# Altium schematic sheet 28P1.SchDoc
size A4
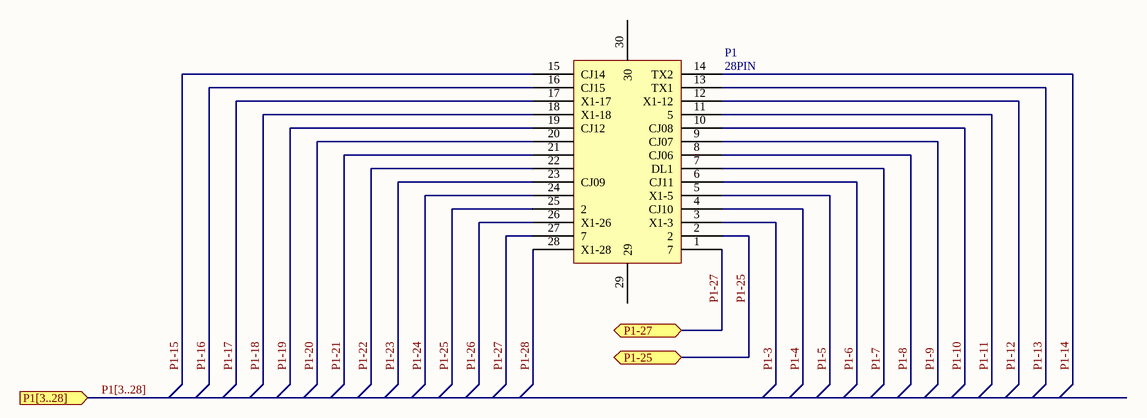
[diagram p0: 28P1.SchDoc]

## Parts
P1  28PIN  [2*14]

## Ports
P1-25, P1-27, P1[3..28]

## Nets
P1-3: P1.3(X1-3)
P1-4: P1.4(CJ10)
P1-5: P1.5(X1-5)
P1-6: P1.6(CJ11)
P1-7: P1.7(DL1)
P1-8: P1.8(CJ06)
P1-9: P1.9(CJ07)
P1-10: P1.10(CJ08)
P1-11: P1.11(5)
P1-12: P1.12(X1-12)
P1-13: P1.13(TX1)
P1-14: P1.14(TX2)
P1-15: P1.15(CJ14)
P1-16: P1.16(CJ15)
P1-17: P1.17(X1-17)
P1-18: P1.18(X1-18)
P1-19: P1.19(CJ12)
P1-20: P1.20
P1-21: P1.21
P1-22: P1.22
P1-23: P1.23(CJ09)
P1-24: P1.24
P1-25: P1.2 P1.25(2) ; port P1-25
P1-26: P1.26(X1-26)
P1-27: P1.1(7) P1.27(7) ; port P1-27
P1-28: P1.28(X1-28)

Not connected (* = marked no-connect by the designer): P1 29 30

## Buses and harness runs
bus P1[3..28] = port P1[3..28]

## Library data of the parts
P1 = Component_1